# EAGLE design SSTuino_Evo (EAGLE 9.6.2)

## Sheet 1 of 2
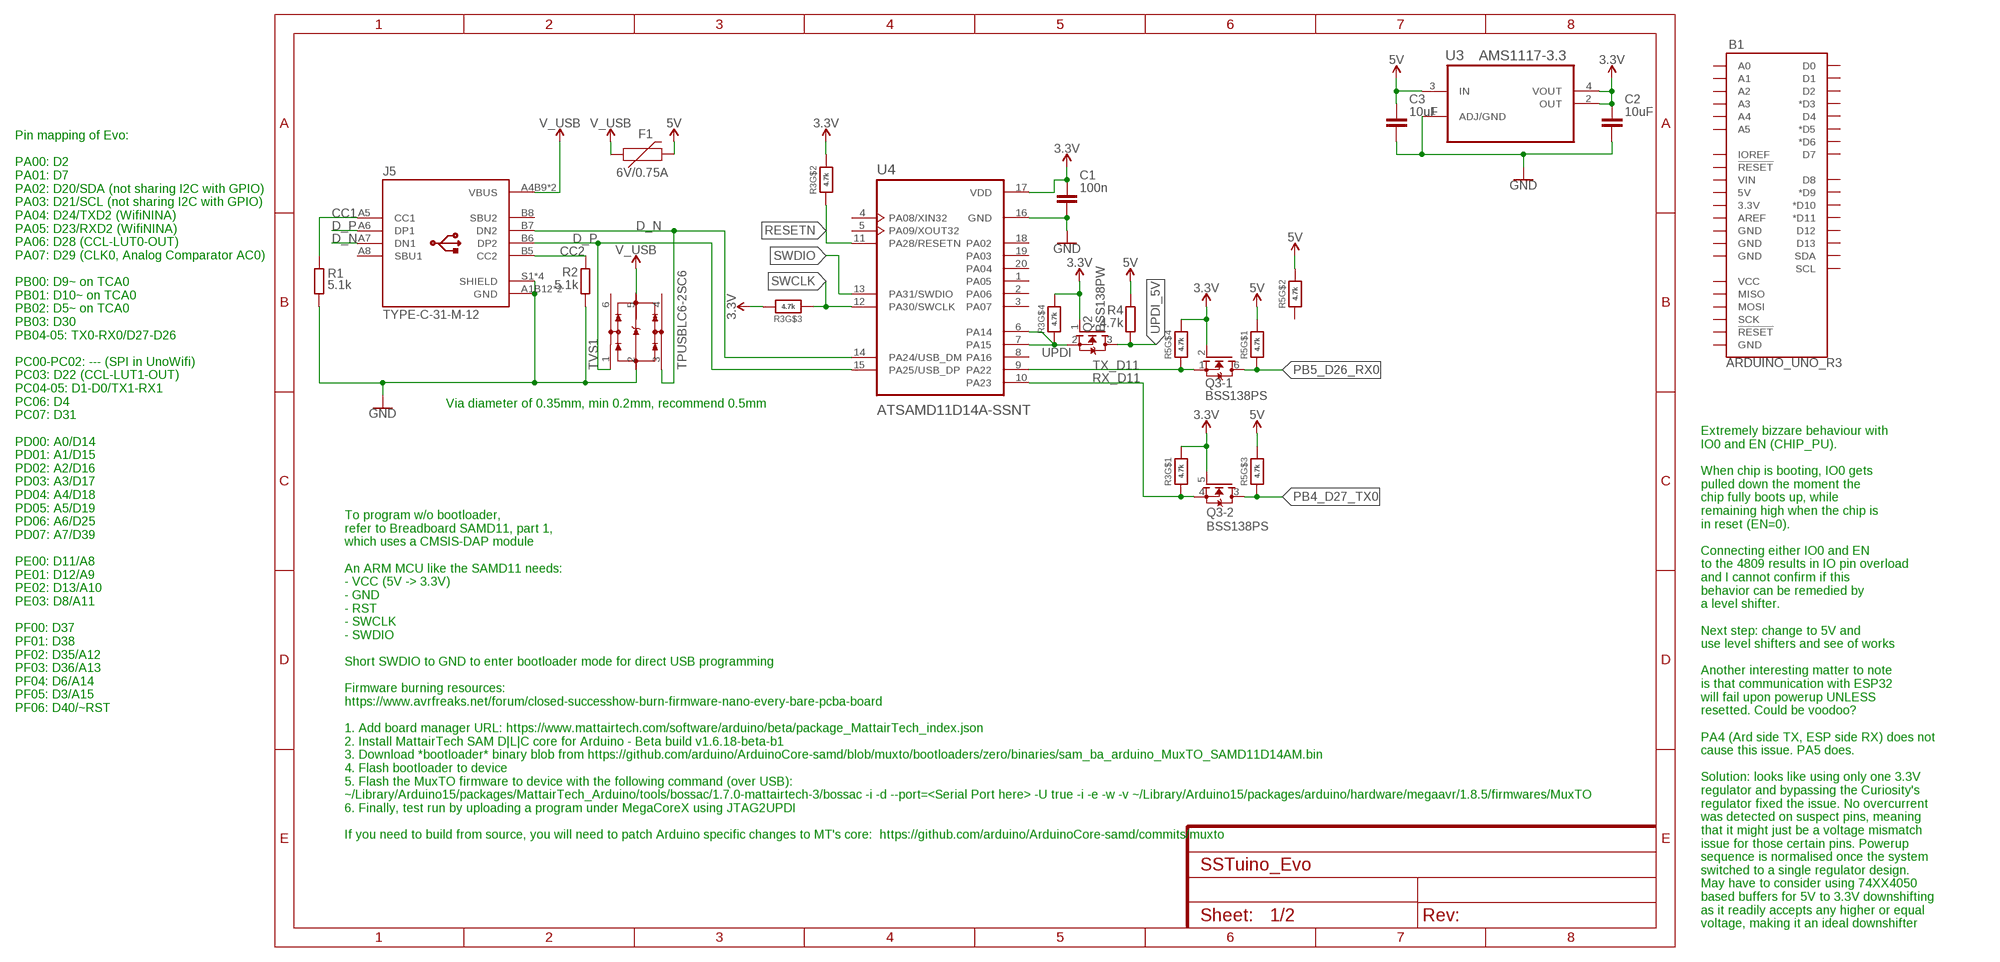
[diagram p0: schematic, sheet 1]

### Parts
B1  ARDUINO_UNO_R3  [ARDUINO_R3]
C1  100n  C_CHIP-0402(1005-METRIC)  [CAPC1005X60]
C2  10uF  C_CHIP-0603(1608-METRIC)  [CAPC1608X85]
C3  10uF  C_CHIP-0603(1608-METRIC)  [CAPC1608X85]
F1  6V/0.75A  PPTC_THREE-QUARTER-AMP  [1206]
J5  TYPE-C-31-M-12  [HRO_TYPE-C-31-M-12]
Q2  BSS138PW  [SOT65P210X110-3N]
Q3  BSS138PS  [ARDUINO-TRANSISTORS_SOT363]
R1  5.1k  R_CHIP-0402(1005-METRIC)  [RESC1005X40]
R2  5.1k  R_CHIP-0402(1005-METRIC)  [RESC1005X40]
R3  4.7k  RESISTOR_4PACK0402  [RESPACK_4X0402]
R4  4.7k  R_CHIP-0402(1005-METRIC)  [RESC1005X40]
R5  4.7k  RESISTOR_4PACK0402  [RESPACK_4X0402]
TVS1  TPUSBLC6-2SC6  [SOT95P280X110-6N]
U3  AMS1117-3.3  LM1117MP-3.3  [SOT230P696X180-4N]
U4  ATSAMD11D14A-SSNT  [SOIC127P1030X265-20N]

### Nets
3.3V: C1.1 C2.1 Q2.1(G) Q3.2(-1:G) Q3.5(-2:G) R3.5 R3.6 R3.7 R3.8 R5.5 U3.2(OUT) U3.4(VOUT) U4.17(VDD) ; also sheet 2
5V: C3.1 F1.2 R4.2 R5.6 R5.7 R5.8 U3.3(IN) ; also sheet 2
CC1: J5.A5(CC1) R1.1
CC2: J5.B5(CC2) R2.2
D_N [differential]: J5.A7(DN1) J5.B7(DN2) TVS1.3(IO2) U4.14(PA24/USB_DM)
D_P [differential]: J5.A6(DP1) J5.B6(DP2) TVS1.1(IO1) U4.15(PA25/USB_DP)
GND: C1.2 C2.2 C3.2 J5.A1B12(GND) J5.B1A12(GND) J5.S1(SHIELD) J5.S2(SHIELD) J5.S3(SHIELD) J5.S4(SHIELD) R1.2 R2.1 TVS1.2(VSS) U3.1(ADJ/GND) U4.16(GND) ; also sheet 2
PB4_D27_TX0: Q3.3(-2:D) R5.3 ; also sheet 2
PB5_D26_RX0: Q3.6(-1:D) R5.1 ; also sheet 2
RESETN: R3.2 U4.11(PA28/RESETN) ; also sheet 2
RX_D11: Q3.4(-2:S) R3.1 U4.10(PA23)
SWCLK: R3.3 U4.12(PA30/SWCLK) ; also sheet 2
SWDIO: U4.13(PA31/SWDIO) ; also sheet 2
TX_D11: Q3.1(-1:S) R5.4 U4.9(PA22)
UPDI: Q2.2(S) R3.4 U4.6(PA14) U4.7(PA15)
UPDI_5V: Q2.3(D) R4.1 ; also sheet 2
V_USB: F1.1 J5.A4B9(VBUS) J5.B4A9(VBUS) TVS1.5(VCC)
Unconnected: B1.3.3V B1.5V B1.A0 B1.A1 B1.A2 B1.A3 B1.A4 B1.A5 B1.AREF B1.D0 B1.D1 B1.D2 B1.D3(*D3) B1.D4 B1.D5(*D5) B1.D6(*D6) B1.D7 B1.D8 B1.D9(*D9) B1.D10(*D10) B1.D11(*D11) B1.D12 B1.D13 B1.GND@1(GND) B1.GND@2(GND) B1.GND@3(GND) B1.GND@4(GND) B1.IOREF B1.MISO B1.MOSI B1.RESET@1(!RESET!) B1.RESET@2(!RESET!) B1.SCK B1.SCL B1.SDA B1.VCC B1.VIN J5.A8(SBU1) J5.B8(SBU2) R5.2 TVS1.4(IO3) TVS1.6(IO4) U4.1(PA05) U4.2(PA06) U4.3(PA07) U4.4(PA08/XIN32) U4.5(PA09/XOUT32) U4.8(PA16) U4.18(PA02) U4.19(PA03) U4.20(PA04)

### Notes on the sheet
- Via diameter of 0.35mm, min 0.2mm, recommend 0.5mm
- Pin mapping of Evo:
  
  PA00: D2
  PA01: D7
  PA02: D20/SDA (not sharing I2C with GPIO)
  PA03: D21/SCL (not sharing I2C with GPIO)
  PA04: D24/TXD2 (WifiNINA)
  PA05: D23/RXD2 (WifiNINA)
  PA06: D28 (CCL-LUT0-OUT)
  PA07: D29 (CLK0, Analog Comparator AC0)
  
  PB00: D9~ on TCA0
  PB01: D10~ on TCA0
  PB02: D5~ on TCA0
  PB03: D30
  PB04-05: TX0-RX0/D27-D26
  
  PC00-PC02: --- (SPI in UnoWifi)
  PC03: D22 (CCL-LUT1-OUT)
  PC04-05: D1-D0/TX1-RX1
  PC06: D4
  PC07: D31
  
  PD00: A0/D14
  PD01: A1/D15
  PD02: A2/D16
  PD03: A3/D17
  PD04: A4/D18
  PD05: A5/D19
  PD06: A6/D25
  PD07: A7/D39
  
  PE00: D11/A8
  PE01: D12/A9
  PE02: D13/A10
  PE03: D8/A11
  
  PF00: D37
  PF01: D38
  PF02: D35/A12
  PF03: D36/A13
  PF04: D6/A14
  PF05: D3/A15
  PF06: D40/~RST
- To program w/o bootloader,
  refer to Breadboard SAMD11, part 1,
  which uses a CMSIS-DAP module
  
  An ARM MCU like the SAMD11 needs:
  - VCC (5V -> 3.3V)
  - GND
  - RST
  - SWCLK
  - SWDIO
  
  Short SWDIO to GND to enter bootloader mode for direct USB programming
  
  Firmware burning resources:
  https://www.avrfreaks.net/forum/closed-successhow-burn-firmware-nano-every-bare-pcba-board
  
  1. Add board manager URL: https://www.mattairtech.com/software/arduino/beta/package_MattairTech_index.json
  2. Install MattairTech SAM D|L|C core for Arduino - Beta build v1.6.18-beta-b1
  3. Download *bootloader* binary blob from https://github.com/arduino/ArduinoCore-samd/blob/muxto/bootloaders/zero/binaries/sam_ba_arduino_MuxTO_SAMD11D14AM.bin
  4. Flash bootloader to device
  5. Flash the MuxTO firmware to device with the following command (over USB): 
  ~/Library/Arduino15/packages/MattairTech_Arduino/tools/bossac/1.7.0-mattairtech-3/bossac -i -d --port=<Serial Port here> -U true -i -e -w -v ~/Library/Arduino15/packages/arduino/hardware/megaavr/1.8.5/firmwares/MuxTO
  6. Finally, test run by uploading a program under MegaCoreX using JTAG2UPDI
  
  If you need to build from source, you will need to patch Arduino specific changes to MT's core:  https://github.com/arduino/ArduinoCore-samd/commits/muxto
- Extremely bizzare behaviour with
  IO0 and EN (CHIP_PU). 
  
  When chip is booting, IO0 gets 
  pulled down the moment the 
  chip fully boots up, while 
  remaining high when the chip is
  in reset (EN=0).
  
  Connecting either IO0 and EN
  to the 4809 results in IO pin overload
  and I cannot confirm if this
  behavior can be remedied by
  a level shifter. 
  
  Next step: change to 5V and
  use level shifters and see of works
  
  Another interesting matter to note
  is that communication with ESP32
  will fail upon powerup UNLESS
  resetted. Could be voodoo?
  
  PA4 (Ard side TX, ESP side RX) does not
  cause this issue. PA5 does.
  
  Solution: looks like using only one 3.3V 
  regulator and bypassing the Curiosity's
  regulator fixed the issue. No overcurrent
  was detected on suspect pins, meaning
  that it might just be a voltage mismatch
  issue for those certain pins. Powerup
  sequence is normalised once the system
  switched to a single regulator design.
  May have to consider using 74XX4050
  based buffers for 5V to 3.3V downshifting
  as it readily accepts any higher or equal
  voltage, making it an ideal downshifter

## Sheet 2 of 2
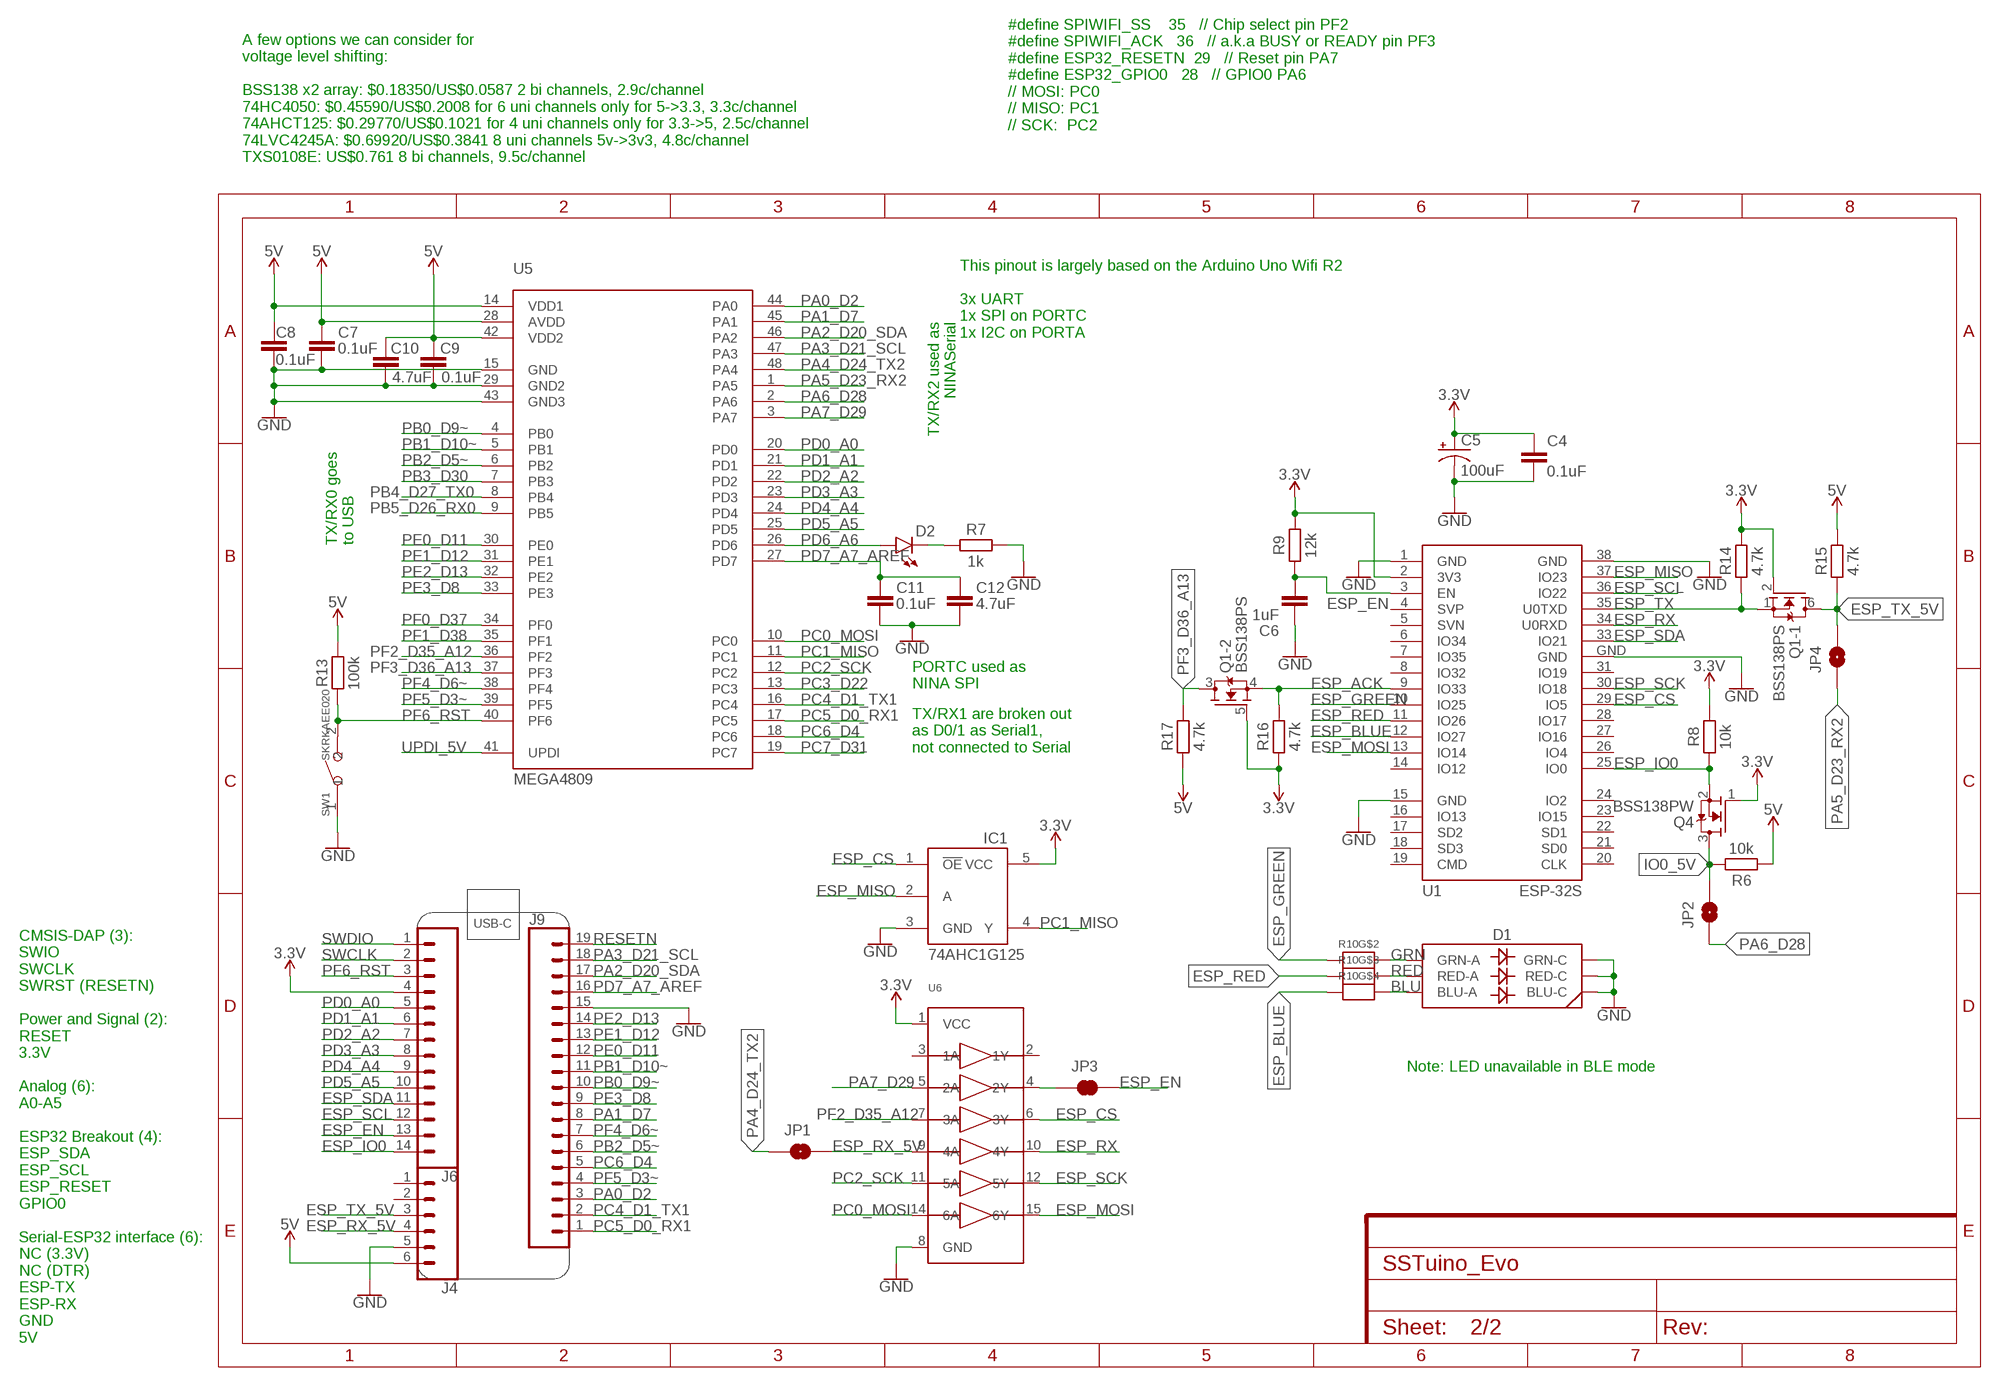
[diagram p1: schematic, sheet 2]

### Parts
C4  0.1uF  C_CHIP-0402(1005-METRIC)  [CAPC1005X60]
C5  100uF  C-POL-US_TANTALUM-1206(3216-METRIC)  [CAPMP3216X180N]
C6  1uF  C_CHIP-0402(1005-METRIC)  [CAPC1005X60]
C7  0.1uF  C_CHIP-0402(1005-METRIC)  [CAPC1005X60]
C8  0.1uF  C_CHIP-0402(1005-METRIC)  [CAPC1005X60]
C9  0.1uF  C_CHIP-0402(1005-METRIC)  [CAPC1005X60]
C10  4.7uF  C_CHIP-0402(1005-METRIC)  [CAPC1005X60]
C11  0.1uF  C_CHIP-0402(1005-METRIC)  [CAPC1005X60]
C12  4.7uF  C_CHIP-0402(1005-METRIC)  [CAPC1005X60]
D1  LED-RGBTC5050RGBF08  [LED-TRICOLOR-5050]
D2  LED0603  [LED-0603]
IC1  74AHC1G125  [SOT23-5L]
J4  CONN_06NO_SILK_FEMALE_PTH  [1X06_NO_SILK]
J6  CONN_14NO_SILK  [1X14_NO_SILK]
J9  CONN_191X19_NO_SILK  [1X19_NO_SILK]
JP1  JUMPER-SMT_2_NO_SILK  [SMT-JUMPER_2_NO_SILK]
JP2  JUMPER-SMT_2_NO_SILK  [SMT-JUMPER_2_NO_SILK]
JP3  JUMPER-SMT_2_NC_TRACE_SILK  [SMT-JUMPER_2_NC_TRACE_SILK]
JP4  JUMPER-SMT_2_NO_SILK  [SMT-JUMPER_2_NO_SILK]
Q1  BSS138PS  [ARDUINO-TRANSISTORS_SOT363]
Q4  BSS138PW  [SOT65P210X110-3N]
R6  10k  R_CHIP-0402(1005-METRIC)  [RESC1005X40]
R7  1k  R_CHIP-0402(1005-METRIC)  [RESC1005X40]
R8  10k  R_CHIP-0402(1005-METRIC)  [RESC1005X40]
R9  12k  R_CHIP-0402(1005-METRIC)  [RESC1005X40]
R10  RESISTOR_4PACK0402  [RESPACK_4X0402]
R13  100k  R_CHIP-0402(1005-METRIC)  [RESC1005X40]
R14  4.7k  R_CHIP-0402(1005-METRIC)  [RESC1005X40]
R15  4.7k  R_CHIP-0402(1005-METRIC)  [RESC1005X40]
R16  4.7k  R_CHIP-0402(1005-METRIC)  [RESC1005X40]
R17  4.7k  R_CHIP-0402(1005-METRIC)  [RESC1005X40]
SW1  SKRKAEE020  SMD-BUTTON(2P-3.9X2.9X1.5+0.4MM)-SKRKAEE020  [SW2-2.6-3.9X2.9X1.5+0.4MM]
U1  ESP-32S  [ESP-32S]
U5  MEGA4809  [TQFP48]
U6  74HC4050DTSSOP  [TSSOP16]

### Nets
3.3V: C4.1 C5.1(+) IC1.5(VCC) J6.4 Q1.2(-1:G) Q1.5(-2:G) Q4.1(G) R8.2 R9.2 R14.2 R16.1 U1.2(3V3) U6.1(VCC) ; also sheet 1
5V: C7.1 C8.1 C9.1 C10.1 J4.6 R6.1 R13.2 R15.2 R17.1 U5.14(VDD1) U5.28(AVDD) U5.42(VDD2) ; also sheet 1
BLU: D1.6(BLU-A) R10.5
ESP_ACK: Q1.4(-2:S) R16.2 U1.9(IO33)
ESP_BLUE: R10.4 U1.12(IO27)
ESP_CS: IC1.1(!OE) U1.29(IO5) U6.6(3Y)
ESP_EN: C6.2 J6.13 JP3.2 R9.1 U1.3(EN)
ESP_GREEN: R10.2 U1.10(IO25)
ESP_IO0: J6.14 Q4.2(S) R8.1 U1.25(IO0)
ESP_MISO: IC1.2(A) U1.37(IO23)
ESP_MOSI: U1.13(IO14) U6.15(6Y)
ESP_RED: R10.3 U1.11(IO26)
ESP_RX: U1.34(U0RXD) U6.10(4Y)
ESP_RX_5V: J4.4 JP1.2 U6.9(4A)
ESP_SCK: U1.30(IO18) U6.12(5Y)
ESP_SCL: J6.12 U1.36(IO22)
ESP_SDA: J6.11 U1.33(IO21)
ESP_TX: Q1.1(-1:S) R14.1 U1.35(U0TXD)
ESP_TX_5V: J4.3 JP4.2 Q1.6(-1:D) R15.1
GND: C4.2 C5.2(-) C6.1 C7.2 C8.2 C9.2 C10.2 C11.2 C12.2 D1.1(BLU-C) D1.2(RED-C) D1.3(GRN-C) IC1.3(GND) J4.5 J9.15 R7.2 SW1.1 U1.1(GND) U1.15(GND) U1.38(GND) U1.GND U5.15(GND) U5.29(GND2) U5.43(GND3) U6.8(GND) ; also sheet 1
GRN: D1.4(GRN-A) R10.7
IO0_5V: JP2.2 Q4.3(D) R6.2
N$2: D2.C R7.1
N$3: JP3.1 U6.4(2Y)
PA0_D2: J9.3 U5.44(PA0)
PA1_D7: J9.8 U5.45(PA1)
PA2_D20_SDA: J9.17 U5.46(PA2)
PA3_D21_SCL: J9.18 U5.47(PA3)
PA4_D24_TX2: JP1.1 U5.48(PA4)
PA5_D23_RX2: JP4.1 U5.1(PA5)
PA6_D28: JP2.1 U5.2(PA6)
PA7_D29: U5.3(PA7) U6.5(2A)
PB0_D9~: J9.10 U5.4(PB0)
PB1_D10~: J9.11 U5.5(PB1)
PB2_D5~: J9.6 U5.6(PB2)
PB3_D30: U5.7(PB3)
PB4_D27_TX0: U5.8(PB4) ; also sheet 1
PB5_D26_RX0: U5.9(PB5) ; also sheet 1
PC0_MOSI: U5.10(PC0) U6.14(6A)
PC1_MISO: IC1.4(Y) U5.11(PC1)
PC2_SCK: U5.12(PC2) U6.11(5A)
PC3_D22: U5.13(PC3)
PC4_D1_TX1: J9.2 U5.16(PC4)
PC5_D0_RX1: J9.1 U5.17(PC5)
PC6_D4: J9.5 U5.18(PC6)
PC7_D31: U5.19(PC7)
PD0_A0: J6.5 U5.20(PD0)
PD1_A1: J6.6 U5.21(PD1)
PD2_A2: J6.7 U5.22(PD2)
PD3_A3: J6.8 U5.23(PD3)
PD4_A4: J6.9 U5.24(PD4)
PD5_A5: J6.10 U5.25(PD5)
PD6_A6: D2.A U5.26(PD6)
PD7_A7_AREF: C11.1 C12.1 J9.16 U5.27(PD7)
PE0_D11: J9.12 U5.30(PE0)
PE1_D12: J9.13 U5.31(PE1)
PE2_D13: J9.14 U5.32(PE2)
PE3_D8: J9.9 U5.33(PE3)
PF0_D37: U5.34(PF0)
PF1_D38: U5.35(PF1)
PF2_D35_A12: U5.36(PF2) U6.7(3A)
PF3_D36_A13: Q1.3(-2:D) R17.2 U5.37(PF3)
PF4_D6~: J9.7 U5.38(PF4)
PF5_D3~: J9.4 U5.39(PF5)
PF6_RST: J6.3 R13.1 SW1.2 U5.40(PF6)
RED: D1.5(RED-A) R10.6
RESETN: J9.19 ; also sheet 1
SWCLK: J6.2 ; also sheet 1
SWDIO: J6.1 ; also sheet 1
UPDI_5V: U5.41(UPDI) ; also sheet 1
Unconnected: J4.1 J4.2 R10.1 R10.8 U1.4(SVP) U1.5(SVN) U1.6(IO34) U1.7(IO35) U1.8(IO32) U1.14(IO12) U1.16(IO13) U1.17(SD2) U1.18(SD3) U1.19(CMD) U1.20(CLK) U1.21(SD0) U1.22(SD1) U1.23(IO15) U1.24(IO2) U1.26(IO4) U1.27(IO16) U1.28(IO17) U1.31(IO19) U6.2(1Y) U6.3(1A)

### Notes on the sheet
- #define SPIWIFI_SS    35   // Chip select pin PF2
  #define SPIWIFI_ACK   36   // a.k.a BUSY or READY pin PF3
  #define ESP32_RESETN  29   // Reset pin PA7
  #define ESP32_GPIO0   28   // GPIO0 PA6
  // MOSI: PC0
  // MISO: PC1
  // SCK:  PC2
- A few options we can consider for
  voltage level shifting:
  
  BSS138 x2 array: $0.18350/US$0.0587 2 bi channels, 2.9c/channel
  74HC4050: $0.45590/US$0.2008 for 6 uni channels only for 5->3.3, 3.3c/channel
  74AHCT125: $0.29770/US$0.1021 for 4 uni channels only for 3.3->5, 2.5c/channel
  74LVC4245A: $0.69920/US$0.3841 8 uni channels 5v->3v3, 4.8c/channel
  TXS0108E: US$0.761 8 bi channels, 9.5c/channel
- TX/RX2 used as
  NINASerial
- This pinout is largely based on the Arduino Uno Wifi R2
  
  3x UART
  1x SPI on PORTC
  1x I2C on PORTA
- TX/RX0 goes
  to USB
- PORTC used as
  NINA SPI
- TX/RX1 are broken out 
  as D0/1 as Serial1,
  not connected to Serial
- USB-C
- Note: LED unavailable in BLE mode
- CMSIS-DAP (3):
  SWIO
  SWCLK
  SWRST (RESETN)
  
  Power and Signal (2):
  RESET
  3.3V
  
  Analog (6):
  A0-A5
  
  ESP32 Breakout (4):
  ESP_SDA
  ESP_SCL
  ESP_RESET
  GPIO0
  
  Serial-ESP32 interface (6):
  NC (3.3V)
  NC (DTR)
  ESP-TX
  ESP-RX
  GND
  5V

## Library data of the parts
B1 = SparkFun-Boards:ARDUINO_UNO_R3: Arduino R3 Footprint with SPI header Arduino Uno R3 Compatible Footprint. Matches PCB size of the original board. SparkFun Products: SAMD21 Dev Breakout <https://www.sparkfun.com/products/13672> RedBoard <https://www.sparkfun.com/products/12757> R3 Stackable Headers <https://www.sparkfun.com/products/11417>
C1-C4 C6-C12 = Capacitor:C: Capacitor - Generic; CATEGORY: Capacitor
C5 = Capacitor:C-POL-US: Capacitor Polarised - ANSI; CATEGORY: Capacitor
D1 = D3ltav's Custom:LED-RGB: LED-RGB 6 pin RGB LED (no common connector) Warning: please check and double check your pinout vs. the datasheet! 5050 SMD LEDs are commonly packaged in all sorts of weird, non-standard pinouts. This footprint and symbol is only applicable to the LED mentioned below Packages: LED-TRICOLOR-5050 - Based on TC5050RGBF08 RGB LED <https://datasheet.lcsc.com/szlcsc/2009231707_TCWIN-TC5050RGBF08-3CJH-AF53A_C784540.pdf>; PROD_ID: DIO-10298
D2 = SparkFun-LED:LED: LED (Generic) Standard schematic elements and footprints for 5mm, 3mm, 1206, and 0603 sized LEDs. Generic LEDs with no color specified.
F1 = SparkFun-Fuses:PPTC: Resettable Fuse PPTC Resettable Fuse. Really a sort of resistor with a polymeric positive temperature coefficient whose resistance increases dramatically with an increase in temperature. When heated by the power passing through the resistance rises causing the current to be limited, protecting the circuit. This is achieved by the transition of the polymer from a crystalline to an amorphous state where the conductive carbon separates breaking the conductive pathways found in the cool crystalline structure. When a PPTC cools back down it resumes conducting letting the circuit turn back on. SparkFun Products: SparkFun RedBoard - Programmed with Arduino <https://www.sparkfun.com/products/12757> Pro Micro - 5V/16MHz <https://www.sparkfun.com/products/12640> Arduino Pro 328 - 5V/16MHz <https://www.sparkfun.com/products/10915> MP3 Trigger <https://www.sparkfun.com/products/13720>; LCSC_PART: C99563; PROD_ID: RES-11150
IC1 = adafruit:74AHC1G125; LCSC_PART: C124295
J4 = SparkFun-Connectors:CONN_06: Multi connection point. Often used as Generic Header-pin footprint for 0.1 inch spaced/style header connections On any of the 0.1 inch spaced packages, you can populate with these: Break Away Headers - Straight <https://www.sparkfun.com/products/116> (PRT-00116) Break Away Male Headers - Right Angle <https://www.sparkfun.com/products/553> (PRT-00553) Female Headers <https://www.sparkfun.com/products/115> (PRT-00115) Break Away Headers - Machine Pin <https://www.sparkfun.com/products/117> (PRT-00117) Break Away Female Headers - Swiss Machine Pin <https://www.sparkfun.com/products/743> (PRT-00743) Arduino Stackable Header - 6 Pin <https://www.sparkfun.com/products/9280> (PRT-09280) For SCREWTERMINALS and SPRING TERMINALS visit here: Screw Terimnals on SparkFun.com <https://www.sparkfun.com/search/results?term=Screw+Terminals> (5mm/3.5mm/2.54mm spacing) This device is also useful as a general connection point to wire up your design to another part of your project. Our various solder wires solder well into these plated through hole pads. Hook-Up Wire - Assortment (Stranded, 22 AWG) <https://www.sparkfun.com/products/11375> (PRT-11375) Hook-Up Wire - Assortment (Solid Core, 22 AWG) <https://www.sparkfun.com/products/11367> (PRT-11367) View the entire wire category on our website here <https://www.sparkfun.com/categories/141>; PROD_ID: CONN-08437
J5 = D3ltav's Custom:TYPE-C-31-M-12: USB Connectors 24 Receptacle 1 8.94*7.3mm RoHS Check prices <https://pricing.snapeda.com/parts/TYPE-C-31-M-12/HRO%20Electronics%20Co.%2C%20Ltd./view-part?ref=eda>; AVAILABILITY: No availability data; DESCRIPTION: USB Connectors 24 Receptacle 1 8.94*7.3mm RoHS; LCSC_PART: C165948; MF: HRO Electronics Co., Ltd.; MP: TYPE-C-31-M-12; PACKAGE: Package; PRICE: None
J6 = SparkFun-Connectors:CONN_14: Multi connection point. Often used as Generic Header-pin footprint for 0.1 inch spaced/style header connections On any of the 0.1 inch spaced packages, you can populate with these: Break Away Headers - Straight <https://www.sparkfun.com/products/116> (PRT-00116) Break Away Male Headers - Right Angle <https://www.sparkfun.com/products/553> (PRT-00553) Female Headers <https://www.sparkfun.com/products/115> (PRT-00115) Break Away Headers - Machine Pin <https://www.sparkfun.com/products/117> (PRT-00117) Break Away Female Headers - Swiss Machine Pin <https://www.sparkfun.com/products/743> (PRT-00743) For SCREWTERMINALS and SPRING TERMINALS visit here: Screw Terimnals on SparkFun.com <https://www.sparkfun.com/search/results?term=Screw+Terminals> (5mm/3.5mm/2.54mm spacing) This device is also useful as a general connection point to wire up your design to another part of your project. Our various solder wires solder well into these plated through hole pads. Hook-Up Wire - Assortment (Stranded, 22 AWG) <https://www.sparkfun.com/products/11375> (PRT-11375) Hook-Up Wire - Assortment (Solid Core, 22 AWG) <https://www.sparkfun.com/products/11367> (PRT-11367) View the entire wire category on our website here <https://www.sparkfun.com/categories/141> Special notes: Molex polarized connector foot print use with SKU : PRT-08231 with associated crimp pins and housings. 1MM SMD Version SKU: PRT-10208 NOTES ON THE VARIANTS LOCK and LOCK_LONGPADS... This footprint was designed to help hold the alignment of a through-hole component (i.e. 6-pin header) while soldering it into place. You may notice that each hole has been shifted either up or down by 0.005 of an inch from it's more standard position (which is a perfectly straight line). This slight alteration caused the pins (the squares in the middle) to touch the edges of the holes. Because they are alternating, it causes a "brace" to hold the component in place. 0.005 has proven to be the perfect amount of "off-center" position when using our standard breakaway headers. Although looks a little odd when you look at the bare footprint, once you have a header in there, the alteration is very hard to notice. Also,if you push a header all the way into place, it is covered up entirely on the bottom side.
J9 = SparkFun-Connectors:CONN_19: Multi connection point. Often used as Generic Header-pin footprint for 0.1 inch spaced/style header connections On any of the 0.1 inch spaced packages, you can populate with these: Break Away Headers - Straight <https://www.sparkfun.com/products/116> (PRT-00116) Break Away Male Headers - Right Angle <https://www.sparkfun.com/products/553> (PRT-00553) Female Headers <https://www.sparkfun.com/products/115> (PRT-00115) Break Away Headers - Machine Pin <https://www.sparkfun.com/products/117> (PRT-00117) Break Away Female Headers - Swiss Machine Pin <https://www.sparkfun.com/products/743> (PRT-00743) For SCREWTERMINALS and SPRING TERMINALS visit here: Screw Terimnals on SparkFun.com <https://www.sparkfun.com/search/results?term=Screw+Terminals> (5mm/3.5mm/2.54mm spacing) This device is also useful as a general connection point to wire up your design to another part of your project. Our various solder wires solder well into these plated through hole pads. Hook-Up Wire - Assortment (Stranded, 22 AWG) <https://www.sparkfun.com/products/11375> (PRT-11375) Hook-Up Wire - Assortment (Solid Core, 22 AWG) <https://www.sparkfun.com/products/11367> (PRT-11367) View the entire wire category on our website here <https://www.sparkfun.com/categories/141> Special notes: Molex polarized connector foot print use with SKU : PRT-08231 with associated crimp pins and housings. 1MM SMD Version SKU: PRT-10208 NOTES ON THE VARIANTS LOCK and LOCK_LONGPADS... This footprint was designed to help hold the alignment of a through-hole component (i.e. 6-pin header) while soldering it into place. You may notice that each hole has been shifted either up or down by 0.005 of an inch from it's more standard position (which is a perfectly straight line). This slight alteration caused the pins (the squares in the middle) to touch the edges of the holes. Because they are alternating, it causes a "brace" to hold the component in place. 0.005 has proven to be the perfect amount of "off-center" position when using our standard breakaway headers. Although looks a little odd when you look at the bare footprint, once you have a header in there, the alteration is very hard to notice. Also,if you push a header all the way into place, it is covered up entirely on the bottom side.
JP1 JP2 JP4 = SparkFun-Jumpers:JUMPER-SMT_2_NO: Normally open jumper This jumper has two pads in close proximity to each other. Apply solder to close the connection. Round pads are easier to solder for beginners, but are a lot larger. SparkFun Product that uses the round pads: SparkFun EL Sequencer <https://www.sparkfun.com/products/12781>
JP3 = SparkFun-Jumpers:JUMPER-SMT_2_NC_TRACE: Normally closed trace jumper This jumper has a trace between two pads so it's normally closed (NC). Use a razor knife to open the connection. For best results follow the IPC guidelines for cutting traces: Cutout at least 0.063 mm (0.005 in). Remove all loose material to clean up the cut area. Seal the cut with an approved epoxy. Reapply solder to reclose the connection.
Q1 Q3 = D3ltav's Custom:BSS138PS: MOSFET 2N-CH 60V 0.32A 6TSSOP; CODE-ARDUINO: 2323; DATASHEET: https://assets.nexperia.com/documents/data-sheet/BSS138PS.pdf; DISTRIBUTOR-LINK: http://www.digikey.com/product-detail/en/nxp-semiconductors/BSS138PS,115/568-8393-1-ND/2763927; DISTRIBUTOR-PN: 568-8393-1-ND; LCSC_PART: C193381; MANUFACTURER: NXP; MANUFACTURER-PN: BSS138PS,115
Q2 Q4 = D3ltav's Custom:BSS138PW: N-channel Trench MOSFET Check prices <https://pricing.snapeda.com/parts/BSS138PW/NXP%20Semiconductors/view-part?ref=eda>; AVAILABILITY: In Stock; DESCRIPTION: N-Channel 60V 320mA (Ta) 260mW (Ta), 830mW (Tc) Surface Mount SC-70; MF: NXP Semiconductors; MP: BSS138PW; PACKAGE: SC-70 NXP Semiconductors; PRICE: None
R1 R2 R4 R6-R9 R13-R17 = Resistor:R: Resistor Fixed - Generic; CATEGORY: Resistor; SUB-CATEGORY: Fixed
R3 R5 = D3ltav's Custom:RESISTOR_4PACK: Resistor Packs (4 resistors) 4 x 0603 10K 1/16W - Digikey: YC164J-10KCT-ND; LCSC_PART: C1980
R10 = D3ltav's Custom:RESISTOR_4PACK: Resistor Packs (4 resistors) 4 x 0603 10K 1/16W - Digikey: YC164J-10KCT-ND
SW1 = D3ltav's Custom:SMD-BUTTON(2P-3.9X2.9X1.5+0.4MM): 311020047; LCSC_PART: C115357; MPN: SKRKAEE020
TVS1 = D3ltav's Custom:TPUSBLC6-2SC6: TPUSBLC6-2SC6 Low Capacitance 2-Line ESD Protection www.sot23.com.tw; LCSC_PART: C558442
U1 = esp32:ESP-32S: Ai-Thinker ESP-32S
U3 = D3ltav's Custom:LM1117MP-3.3: Linear regulators; LCSC_PART: C6186; MPN: LM1117MP-3.3; OC_FARNELL: 9778195; OC_NEWARK: 41K3470; PACKAGE: SOT223-3; SUPPLIER: NationalSemiconductor
U4 = D3ltav's Custom:ATSAMD11D14A-SSNT; AVAILABILITY: In Stock; DESCRIPTION: ARM® Cortex®-M0+ SAM D11D Microcontroller IC 32-Bit 48MHz 16KB (16K x 8) FLASH 20-SOIC; LCSC_PART: C2053599; MF: Microchip; MP: ATSAMD11D14A-SSNT; PACKAGE: SOIC-20 Microchip; PRICE: None
U5 = microwavemont_ATMEGA4809:MEGA4809; LCSC_PART: C189475
U6 = D3ltav's Custom:74HC4050D: 6-channel level shifter 74HC4050D - 2V-6V Supply SOIC16 Digikey: 74HC4050D,653-ND Mouser: 771-74HC4050D-T TSSOP16 Digikey: 296-9215-1-ND Mouser:; LCSC_PART: C352825

## Net classes
0 default: width 0.203 mm, drill 0.35 mm
1 differential: width 0.254 mm

## Board
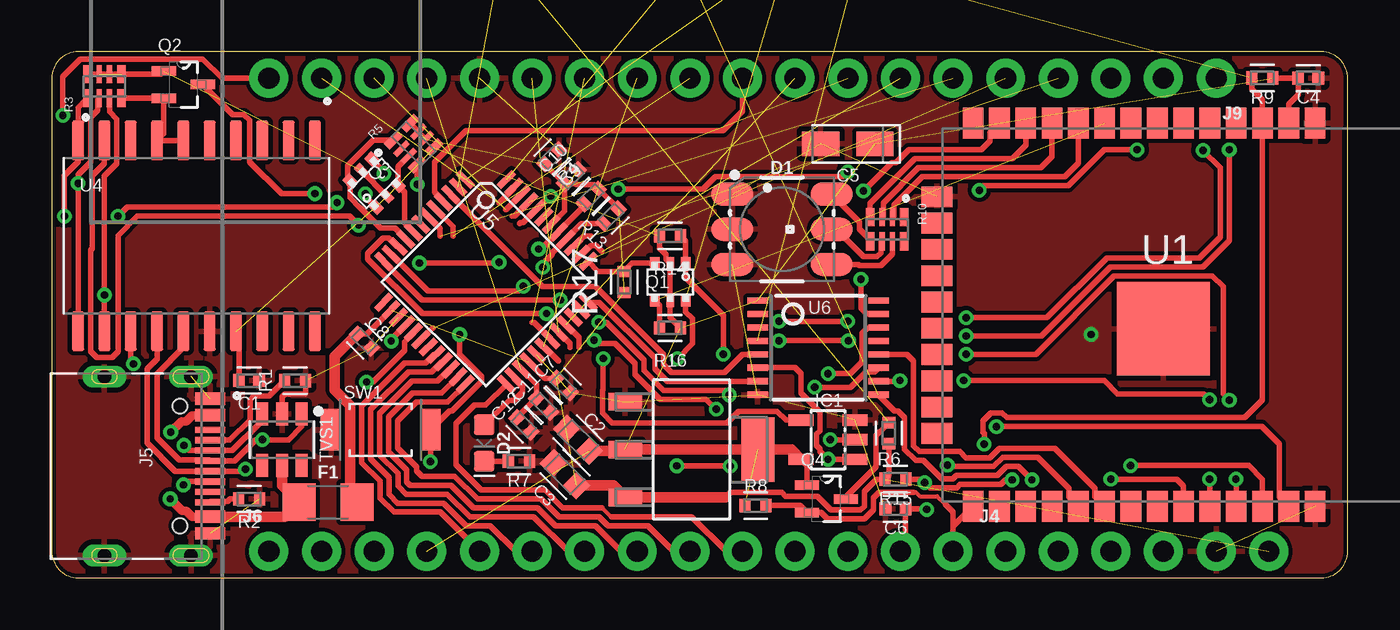
[diagram p2: board, top side]
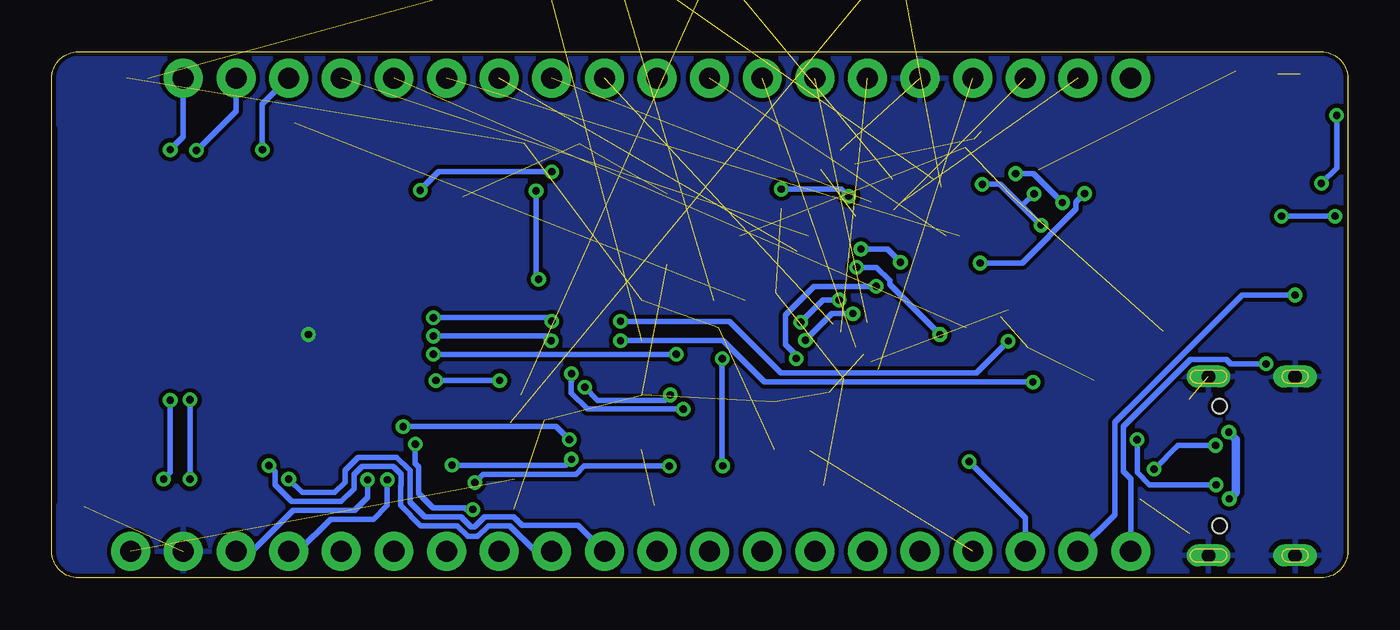
[diagram p3: board, bottom side, seen from below]

Size 62.55 x 25.4 mm. Coordinates in mm from the lower left corner, seen from the top.
Outline: 0,24.13 0,1.27 arc90 1.27,0 61.28,0 arc90 62.55,1.27 62.55,24.13 arc90 61.28,25.4 1.27,25.4 arc90 0,24.13
Copper layers (1*16): Top 0.035mm / dielectric 1.5mm / Bottom 0.035mm
Design rules "SparkFun-2-Layer-General-JLCPCB": minimum track width 7mil, minimum drill 0.3mm, track to track 7mil, track to pad 7mil, pad to pad 7mil, via to via 7mil, smd to smd 7mil, copper to edge 7mil, drill to drill 7mil, minimum pad ring 7mil, minimum via ring 7mil, stop-mask expansion 3mil, vias tented up to drill 25mil, thermal gap 10mil

### Footprints (pad centres in the part's own frame; a part is rotated, then mirrored left to right if it is on the bottom)
ARDUINO_R3 = drill 1.016 pad 1.93: 3.3V 2.54,-24.13; 5V 5.08,-24.13; A0 17.78,-24.13; A1 20.32,-24.13; A2 22.86,-24.13; A3 25.4,-24.13; A4 27.94,-24.13; A5 30.48,-24.13; AREF -9.144,24.13; D0 30.48,24.13; D1 27.94,24.13; D2 25.4,24.13; D3 22.86,24.13; D4 20.32,24.13; D5 17.78,24.13; D6 15.24,24.13; D7 12.7,24.13; D8 8.636,24.13; D9 6.096,24.13; D10 3.556,24.13; D11 1.016,24.13; D12 -1.524,24.13; D13 -4.064,24.13; GND@1 7.62,-24.13; GND@2 10.16,-24.13; GND@3 -6.604,24.13; GND@4 33.16,-1.32; IOREF -2.54,-24.13; MISO 30.62,3.76; MOSI 33.16,1.22; NC -5.08,-24.13; RESET@1 0,-24.13; RESET@2 30.62,-1.32; SCK 30.62,1.22; SCL -14.224,24.13; SDA -11.684,24.13; VCC 33.16,3.76; VIN 12.7,-24.13 | hole 3.175: -17.78,24.13; 33.02,8.89; 33.02,-19.05; -19.05,-24.13
CAPC1005X60 = smd 0.56 x 0.629: 1 -0.485,0; 2 0.485,0
CAPC1608X85 = smd 0.921 x 0.97: 1 -0.775,0; 2 0.775,0
CAPMP3216X180N = smd 1.796 x 1.189: 1 -1.31,0; 2 1.31,0
LED-TRICOLOR-5050 = smd 2 x 1.1: 1 2.4,-1.7; 2 2.4,0; 3 2.4,1.7; 4 -2.4,1.7; 5 -2.4,0; 6 -2.4,-1.7
LED-0603 = smd 1 x 1: A -0.877,0; C 0.877,0
1206 = smd 1.6 x 1.8: 1 -1.4,0; 2 1.4,0
SOT23-5L = smd 0.55 x 1.2: 1 -0.95,-1.3; 2 0,-1.3; 3 0.95,-1.3; 4 0.95,1.3; 5 -0.95,1.3
1X06_NO_SILK = drill 1.016 pad 1.88: 1 0,0; 2 2.54,0; 3 5.08,0; 4 7.62,0; 5 10.16,0; 6 12.7,0
HRO_TYPE-C-31-M-12 = smd 0.6 x 1.45: A1B12 -3.25,5.095; A4B9 -2.45,5.095; B1A12 3.25,5.095; B4A9 2.45,5.095 | smd 0.3 x 1.45: A5 -1.25,5.095; A6 -0.25,5.095; A7 0.25,5.095; A8 1.25,5.095; B5 1.75,5.095; B6 0.75,5.095; B7 -0.75,5.095; B8 -1.75,5.095 | drill 0.65 pad 1.05 long: S1 -4.32,4.18; S2 4.32,4.18; S3 -4.32,0; S4 4.32,0 | hole 0.7: -2.89,3.65; 2.89,3.65
1X14_NO_SILK = drill 1.016 pad 1.88: 1 0,0; 2 2.54,0; 3 5.08,0; 4 7.62,0; 5 10.16,0; 6 12.7,0; 7 15.24,0; 8 17.78,0; 9 20.32,0; 10 22.86,0; 11 25.4,0; 12 27.94,0; 13 30.48,0; 14 33.02,0
1X19_NO_SILK = drill 1.016 pad 1.88: 1 0,0; 2 2.54,0; 3 5.08,0; 4 7.62,0; 5 10.16,0; 6 12.7,0; 7 15.24,0; 8 17.78,0; 9 20.32,0; 10 22.86,0; 11 25.4,0; 12 27.94,0; 13 30.48,0; 14 33.02,0; 15 35.56,0; 16 38.1,0; 17 40.64,0; 18 43.18,0; 19 45.72,0
SMT-JUMPER_2_NO_SILK = smd 0.635 x 1.27: 1 -0.406,0; 2 0.406,0
SMT-JUMPER_2_NC_TRACE_SILK = smd 0.635 x 1.27: 1 -0.508,0; 2 0.508,0
ARDUINO-TRANSISTORS_SOT363 = smd 0.5 x 0.6: 1 -0.75,-0.9; 3 0.75,-0.9; 4 0.75,0.9; 6 -0.75,0.9 | smd 0.4 x 0.6: 2 0,-0.9; 5 0,0.9
SOT65P210X110-3N = smd 1.168 x 0.457: 1 -0.94,0.66; 2 -0.94,-0.66; 3 0.94,0
RESC1005X40 = smd 0.535 x 0.644: 1 -0.507,0; 2 0.507,0
RESPACK_4X0402 = smd 0.87 x 0.41: 1 -0.58,0.825; 4 -0.58,-0.825; 5 0.58,-0.825; 8 0.58,0.825 | smd 0.87 x 0.26: 2 -0.58,0.25; 3 -0.58,-0.25; 6 0.58,-0.25; 7 0.58,0.25
SW2-2.6-3.9X2.9X1.5+0.4MM = smd 1 x 2: 1 -2.4,0; 2 2.4,0
SOT95P280X110-6N = smd 1.119 x 0.584: 1 -1.246,0.95; 2 -1.246,0; 3 -1.246,-0.95; 4 1.246,-0.95; 5 1.246,0; 6 1.246,0.95
ESP-32S = smd 1.5 x 1: 1 -9.25,7; 2 -9.25,5.73; 3 -9.25,4.46; 4 -9.25,3.19; 5 -9.25,1.92; 6 -9.25,0.65; 7 -9.25,-0.62; 8 -9.25,-1.89; 9 -9.25,-3.16; 10 -9.25,-4.43; 11 -9.25,-5.7; 12 -9.25,-6.97; 13 -9.25,-8.24; 14 -9.25,-9.51; 25 9.25,-9.51; 26 9.25,-8.24; 27 9.25,-6.97; 28 9.25,-5.7; 29 9.25,-4.43; 30 9.25,-3.16; 31 9.25,-1.89; 32 9.25,-0.62; 33 9.25,0.65; 34 9.25,1.92; 35 9.25,3.19; 36 9.25,4.46; 37 9.25,5.73; 38 9.25,7 | smd 1 x 1.5: 15 -5.7,-11.25; 16 -4.43,-11.25; 17 -3.16,-11.25; 18 -1.89,-11.25; 19 -0.62,-11.25; 20 0.65,-11.25; 21 1.92,-11.25; 22 3.19,-11.25; 23 4.46,-11.25; 24 5.73,-11.25 | smd 4.5 x 4.5: GND 0.68,-0.33
SOT230P696X180-4N = smd 1.6 x 0.838: 1 -3.2,2.311; 2 -3.2,0; 3 -3.2,-2.311 | smd 1.6 x 3.099: 4 3.2,0
SOIC127P1030X265-20N = smd 1.9 x 0.6: 1 -4.605,5.715; 2 -4.605,4.445; 3 -4.605,3.175; 4 -4.605,1.905; 5 -4.605,0.635; 6 -4.605,-0.635; 7 -4.605,-1.905; 8 -4.605,-3.175; 9 -4.605,-4.445; 10 -4.605,-5.715; 11 4.605,-5.715; 12 4.605,-4.445; 13 4.605,-3.175; 14 4.605,-1.905; 15 4.605,-0.635; 16 4.605,0.635; 17 4.605,1.905; 18 4.605,3.175; 19 4.605,4.445; 20 4.605,5.715
TQFP48 = smd 1.016 x 0.305: 1 -4.191,2.794; 2 -4.191,2.286; 3 -4.191,1.778; 4 -4.191,1.27; 5 -4.191,0.762; 6 -4.191,0.254; 7 -4.191,-0.254; 8 -4.191,-0.762; 9 -4.191,-1.27; 10 -4.191,-1.778; 11 -4.191,-2.286; 12 -4.191,-2.794; 25 4.191,-2.794; 26 4.191,-2.286; 27 4.191,-1.778; 28 4.191,-1.27; 29 4.191,-0.762; 30 4.191,-0.254; 31 4.191,0.254; 32 4.191,0.762; 33 4.191,1.27; 34 4.191,1.778; 35 4.191,2.286; 36 4.191,2.794 | smd 0.305 x 1.016: 13 -2.794,-4.191; 14 -2.286,-4.191; 15 -1.778,-4.191; 16 -1.27,-4.191; 17 -0.762,-4.191; 18 -0.254,-4.191; 19 0.254,-4.191; 20 0.762,-4.191; 21 1.27,-4.191; 22 1.778,-4.191; 23 2.286,-4.191; 24 2.794,-4.191; 37 2.794,4.191; 38 2.286,4.191; 39 1.778,4.191; 40 1.27,4.191; 41 0.762,4.191; 42 0.254,4.191; 43 -0.254,4.191; 44 -0.762,4.191; 45 -1.27,4.191; 46 -1.778,4.191; 47 -2.286,4.191; 48 -2.794,4.191
TSSOP16 = smd 0.305 x 0.991: 1 -2.275,-2.918; 2 -1.625,-2.918; 3 -0.975,-2.918; 4 -0.325,-2.918; 5 0.325,-2.918; 6 0.975,-2.918; 7 1.625,-2.918; 8 2.275,-2.918; 9 2.275,2.918; 10 1.625,2.918; 11 0.975,2.918; 12 0.325,2.918; 13 -0.325,2.918; 14 -0.975,2.918; 15 -1.625,2.918; 16 -2.275,2.918

### Placement (x,y rotation side)
B1  41.27,11.43 0 top
C1  9.53,9.53 0 top
C2  25.4,6.67 135 top
C3  24.77,5 135 top
C4  60.64,24.13 0 top
C5  38.42,20.95 180 top
C6  40.72,3.33 0 top
C7  24.69,9.29 315 top
C8  15.08,11.43 315 top
C9  24.13,20.32 45 top
C10  25.08,19.37 45 top
C11  23.73,8.33 315 top
C12  22.78,7.38 315 top
D1  35.24,16.83 180 top
D2  20.88,6.51 270 top
F1  13.34,3.65 0 top
IC1  37.47,6.67 90 top
J4  46.04,1.27 0 top
J5  2.54,5.4 270 top
J6  10.48,1.27 0 top
J9  56.2,24.13 180 top
JP1  30.8,29.53 270 bottom  (outside the outline)
JP2  21.59,29.84 90 bottom  (outside the outline)
JP3  39.05,29.84 270 bottom  (outside the outline)
JP4  35.24,29.53 270 bottom  (outside the outline)
Q1  29.84,14.29 180 top
Q2  6.35,23.81 0 top
Q3  15.56,19.05 45 top
Q4  37.39,3.81 0 top
R1  11.75,9.53 0 top
R2  9.53,3.81 180 top
R3  2.54,23.73 90 top
R4  26.04,18.41 45 top
R5  17.46,20.95 45 top
R6  40.4,6.99 90 top
R7  22.54,5.64 0 top
R8  33.97,3.49 180 top
R9  58.42,24.13 0 top
R10  40.32,16.83 270 top
R13  26.99,17.46 45 top
R14  29.84,16.51 180 top
R15  40.72,4.76 180 top
R16  29.84,12.06 180 top
R17  27.62,14.29 90 top
SW1  15.88,7.14 0 top
TVS1  11.11,6.67 270 top
U1  53.98,12.7 270 top
U3  30.88,6.19 0 top
U4  6.99,16.51 270 top
U5  20.95,14.29 315 top
U6  36.99,11.11 270 top

### Tracks (layer width: path | path; a pad name or v marks a point on that pad's centre or on a via)
3.3V  (12 unrouted)
  Top 0.254: IC1.5 36.45,5.44 Q4.1 | R14.2 29.34,15.91 29.65,15.6 29.65,15.38 Q1.2 Q1.5 29.84,12.58 29.91,12.51 R16.1 | Q3.5 Q3.2 | R3.8 R3.5 5.25,24.31 Q2.1 | R9.2 C4.1 60.17,23.34 59.7,22.88 U1.2 | U4.17 9.04,11.76 C1.1
  Top 0.508: IC1.5 35.69,6.19 U3.4 U3.2 27.61,6.12 C2.1
5V  (7 unrouted)
  Top 0.254: 32.51,3.88 32.75,4.12 35.24,4.12 35.42,3.94 36.95,3.94 37.62,3.28 39.04,3.28 39.21,3.46 39.21,4.17 39.8,4.76 R15.2 40.4,4.95 R6.1 | C10.1 24.74,17.71 U5.42 | C9.1 C10.1 | C10.1 25.28,19.02 25.32,18.98 26.18,18.98 R4.2 R13.2 | R5.8 R5.6 | U5.14 15.21,11.77 C8.1 | C7.1 23.82,9.63 U5.28
  Top 0.508: 32.51,3.88 U3.3 27.1,4.45 C3.1 | F1.2 14.41,3.98 14.41,8.32 13.65,9.08 13.65,10.69 C8.1
BLU
  Top 0.254: D1.6 38.99,17.18 38.99,16.85 39.5,16.34 R10.5
CC1
  Top 0.254: R1.1 10.49,8.78 9.74,8.78 9.57,8.6 9.57,7.62 8.59,6.65 J5.A5
CC2
  Top 0.254: J5.B5 7.68,3.69 8.49,3.69 8.6,3.81 R2.2
D_N  (via drill 0.35)
  Top 0.254: TVS1.3 10,7.91 10,7.44 8.7,6.15 J5.B7 6.62,6.15 v6.38,6.39 | U4.14 5.08,10.56 4.6,10.08 4.6,6.51 5.96,5.15 J5.A7 9.24,5.15 v9.34,5.24
  Bottom 0.254: v9.34,5.24 8.19,6.39 v6.38,6.39
D_P  (via drill 0.35)
  Top 0.254: TVS1.1 12.06,7.3 11.43,6.67 v10.16,6.67 9.84,6.67 8.81,5.65 J5.A6 7.59,5.69 6.15,5.69 5.08,6.76 5.08,9.84 6.35,11.11 U4.15 | J5.B6 6.51,4.65 v6.35,4.49
  Bottom 0.254: v6.35,4.49 9.57,4.49 10.16,5.08 v10.16,6.67
ESP_ACK  (1 unrouted)
  Top 0.254: Q1.4 29.34,13.14 R16.2
ESP_BLUE
  Top 0.254: U1.12 47.01,20.88 46.35,20.23 41.65,20.23 39.5,18.07 R10.4
ESP_CS  (via drill 0.35)
  Top 0.254: U1.29 49.08,3.92 49.08,4.33 47.59,5.82 45.9,5.82 45.45,5.37 43.3,5.37 v43.23,5.44 | IC1.1 v37.47,5.71 37.07,6.11 37.07,6.24 36.91,6.39 36.91,6.94 37.07,7.1 37.07,8.02 36.16,8.93 36.16,9.88 35.88,10.16 34.09,10.16 U6.6
  Bottom 0.254: v43.23,5.44 37.74,5.44 v37.47,5.71
ESP_EN  (via drill 0.35)  (1 unrouted)
  Top 0.254: J6.13 41.2,1.52 C6.2 42.2,3.33 v42.23,3.3 | R9.1 57.91,23.61 58.44,23.08 U1.3 58.44,8.59 57.58,7.73 46.09,7.73 45.87,7.96 45.32,7.96 44.94,7.58 44.94,7.03 45,6.96 v45,6.46
  Bottom 0.254: v42.23,3.3 42.55,3.3 42.62,3.38 44.13,3.38 44.83,4.08 44.83,5.36 45,5.53 v45,6.46
ESP_GREEN
  Top 0.254: R10.2 40.64,17.47 40.64,17.99 42.01,19.37 48.9,19.37 49.55,20.02 U1.10
ESP_IO0
  Top 0.203: 41.59,4.14 41.7,4.14 41.9,3.94 42.73,3.94 43.13,3.54
  Top 0.254: R8.1 36.1,3.49 Q4.2 37.13,3.15 37.44,2.85 39.22,2.85 39.65,3.28 39.65,3.85 39.93,4.14 41.59,4.14 | U1.25 43.5,2.48 J6.14 43.5,3.17 43.13,3.54
ESP_MISO  (via drill 0.35)
  Top 0.254: U1.37 59.24,3.92 59.24,6.46 58.4,7.3 v45.59,7.3 | v37.57,6.67 IC1.2
  Bottom 0.254: v45.59,7.3 38.2,7.3 v37.57,6.67
ESP_MOSI  (via drill 0.35)
  Top 0.254: U1.13 45.27,21.48 45.27,21.07 44.86,20.66 41.36,20.66 40.75,20.06 40.55,20.06 v39.17,18.68 | U6.15 39.33,12.74 39.05,13.02 v39.05,14.42
  Bottom 0.254: v39.17,18.68 39.17,14.54 v39.05,14.42
ESP_RED
  Top 0.254: R10.3 40.14,17.47 40.14,18.1 41.83,19.8 47.74,19.8 48.27,20.34 U1.11
ESP_RX  (via drill 0.35)
  Top 0.254: U6.10 40.9,9.49 v40.94,9.53 | v44.01,9.53 50.8,9.53 51.44,8.89 55.59,8.89 v55.88,8.6 | v55.88,4.76 55.9,4.75 U1.34
  Bottom 0.254: v40.94,9.53 v44.01,9.53 | v55.88,8.6 v55.88,4.76
ESP_RX_5V  (via drill 0.35)  (1 unrouted)
  Top 0.254: U6.9 40.68,8.06 40.85,8.06 41.16,7.75 41.16,6.2 41.7,5.66 42.07,5.66 42.96,4.78 43.5,4.78 43.66,4.94 45.63,4.94 46.08,5.39 46.65,5.39 v47.31,4.73
  Bottom 0.254: v47.31,4.73 47.31,3.89 47.94,3.26 50.89,3.26 52.88,1.27 J4.4
ESP_SCK
  Top 0.254: U1.30 50.35,3.92 50.35,4.33 48.42,6.25 45.73,6.25 45.27,5.8 44.11,5.8 43.82,6.09 41.88,6.09 41.59,6.38 41.59,10.48 41.28,10.79 U6.12
ESP_SCL  (via drill 0.35)
  Top 0.254: v52.07,5.42 57.76,5.42 58.44,4.75 U1.36
  Bottom 0.254: v52.07,5.42 51.77,5.12 51.77,4.49 50.97,3.69 48.58,3.69 47.97,4.3 47.97,5 47.58,5.39 46.08,5.39 45.7,5 45.7,4.46 45.72,4.44 45.72,3.49 44.74,2.52 42.98,2.52 42.46,1.99 42,1.99 41.47,2.52 40.44,2.52 39.2,1.27 J6.12
ESP_SDA  (via drill 0.35)
  Top 0.254: v51.12,4.76 54.29,4.76 54.62,4.43 U1.33
  Bottom 0.254: J6.11 37.15,2.54 39.86,2.54 40.26,2.95 41.65,2.95 42.14,2.46 42.31,2.46 42.8,2.95 44.56,2.95 45.27,3.65 45.27,5.18 45.9,5.82 47.76,5.82 48.4,5.18 48.4,4.62 48.9,4.12 50.48,4.12 v51.12,4.76
ESP_TX  (via drill 0.35)
  Top 0.254: R14.1 30.59,16.27 Q1.1 30.59,14.49 32.41,12.68 v32.41,10.8 | v56.83,8.57 56.54,8.87 56.54,14.06 56.02,14.57 51.27,14.57 47.49,10.79 v44.13,10.79 | v57.15,4.76 57.16,4.75 U1.35
  Bottom 0.254: v32.41,10.8 v32.41,10.79 v44.13,10.79 | v56.83,8.57 56.83,5.08 v57.15,4.76
ESP_TX_5V  (via drill 0.35)  (1 unrouted)
  Top 0.254: v46.35,4.73 46.04,4.73 45.81,4.5 43.84,4.5 43.68,4.35 42.38,4.35 v42.13,4.6 41.97,4.76 R15.1 | Q1.6 30.59,12.84 30.93,12.51 30.93,11.31 v30.19,10.58 | v30.16,5.41 32.74,5.41 v32.75,5.4
  Bottom 0.254: J4.3 50.66,1.27 49.1,2.83 47.02,2.83 46.35,3.49 v46.35,4.73 | v30.19,10.58 30.19,5.44 v30.16,5.41 | v32.75,5.4 36.85,5.4 37.25,5 41.73,5 v42.13,4.6
GND  (via drill 0.35)  (15 unrouted)
  Top 0.254: TVS1.2 11.11,8.73 11.27,8.89 12.22,8.89 12.26,8.92 R1.2
  other vias: 50.16,11.75
  pour Top (isolate 0.203): 0,25.4 62.23,25.4 62.23,0 0,0
  pour Bottom (isolate 0.203): 0,25.4 62.23,25.4 62.23,0 0,0
GRN
  Top 0.254: D1.4 38.94,15.13 38.99,15.08 40.01,15.08 40.57,15.64 R10.7
IO0_5V  (1 unrouted)
  Top 0.254: 40.4,7.42 R6.2 39.96,7.05 39.95,7.05 39.77,6.87 39.77,5.35 38.33,3.9 Q4.3
N$2
  Top 0.254: R7.1 D2.C
N$3  (1 unrouted)
PA0_D2  (via drill 0.35)
  Top 0.254: 22.59,17.1 22.63,17.14 22.73,17.14 U5.44 24.02,18.43 v24.08,18.43 | v27.34,18.77 31.43,18.77 32.04,19.38 38.19,19.38 v38.42,19.61 | v44.77,18.71 44.99,18.94 49.07,18.94 50.81,20.67 v52.39,20.67
  Bottom 0.254: v24.08,18.43 24.42,18.77 v27.34,18.77 | J9.3 52.39,22.86 v52.39,20.67 | v44.77,18.71 43.87,19.61 v38.42,19.61
PA1_D7  (1 unrouted)
  Top 0.254: U5.45 22.33,17.46 22.23,17.46 | 22.23,17.46
PA2_D20_SDA  (1 unrouted)
  Top 0.254: U5.46 21.93,17.78 21.91,17.78
PA3_D21_SCL  (1 unrouted)
  Top 0.254: U5.47 22.3,18.81 21.59,18.1
PA4_D24_TX2  (1 unrouted)
PA5_D23_RX2  (1 unrouted)
PA6_D28  (1 unrouted)
PA7_D29
  Top 0.254: U5.3 23.69,14.07 26.25,14.07 29.54,10.79 29.54,10.3 29.92,9.92 32.46,9.92 33.33,10.79 U6.5
PB0_D9~
  Top 0.254: U5.4 18.89,18.22 18.48,18.63 18.48,20.06 20,21.59 32.38,21.59 33.34,22.54 J9.10
PB1_D10~  (1 unrouted)
  Top 0.254: U5.5 19.37,16.95 19.37,16.51
PB2_D5~  (1 unrouted)
  Top 0.254: U5.6 18.73,16.87 18.73,16.51
PB4_D27_TX0
  Top 0.254: R5.3 16.72,19.86 Q3.3 17.04,18.63 17.04,17.12 U5.8
PB5_D26_RX0
  Top 0.254: U5.9 16.56,16.88 15.88,16.88 14.88,17.89 14.86,17.89 14.39,18.36 Q3.6 14.27,19.28 14.27,19.89 15.51,21.13 R5.1
PC0_MOSI  (via drill 0.35)
  Top 0.254: v32.07,8.14 31.59,8.62 29.35,8.62 28.14,9.83 28.14,10.35 27.18,11.31 26.34,11.31 v26.17,11.48 | U5.10 16.66,15.99 16.25,16.41 16,16.41 15.24,15.65 15.24,15.4 17.89,12.76 v23.88,12.76 | v37.47,9.86 38.55,9.86 39.11,10.42 39.11,11.8 39.37,12.06 39.88,12.06 U6.14
  Bottom 0.254: v37.47,9.86 37.47,9.48 37.48,9.47 37.48,8.93 36.7,8.14 v32.07,8.14 | v26.17,11.48 24.89,12.76 v23.88,12.76
PC1_MISO  (via drill 0.35)
  Top 0.254: U5.11 18.16,13.85 22.53,13.85 v22.76,14.07 | v26.61,10.59 26.61,9.09 26.57,9.05 26.57,7.96 27.04,7.49 32.59,7.49 33.15,8.04 35,8.04 35.43,7.62 IC1.4
  Bottom 0.254: v22.76,14.07 25.76,14.07 27.14,12.69 27.14,11.27 26.61,10.75 v26.61,10.59
PC2_SCK  (via drill 0.35)
  Top 0.254: U6.11 39.71,9.95 39.28,9.95 38.54,9.2 v36.82,9.2 | v32.7,8.83 32.48,9.06 29.53,9.06 28.57,10.01 28.57,10.53 26.76,12.34 v26.4,12.34 | v24.54,13.41 17.88,13.41 U5.12
  Bottom 0.254: v26.4,12.34 25.33,13.41 v24.54,13.41 | v36.82,9.2 36.2,8.57 32.96,8.57 v32.7,8.83
PC4_D1_TX1  (via drill 0.35)
  Top 0.254: U5.16 16.38,11.51 v16.38,11.43 | v55.56,20.64 56.4,19.8 56.4,16.45 55.38,15.44 50.91,15.44 48.03,12.56 v44.13,12.56 | v38.42,12.38 v35.1,12.38
  Bottom 0.254: J9.2 53.66,22.54 v55.56,20.64 | v44.13,12.56 38.6,12.56 v38.42,12.38 | v35.1,12.38 29.84,12.38 27.35,9.89 17.93,9.89 v16.38,11.43
PC5_D0_RX1  (via drill 0.35)
  Top 0.254: U5.17 17.45,11.79 17.04,11.38 17.04,10.98 15.51,9.45 v15.19,9.45 | v56.83,20.67 56.83,16.28 55.56,15.01 51.09,15.01 47.76,11.68 v44.13,11.68 | v38.45,11.45 v35.1,11.45
  Bottom 0.254: J9.1 56.2,21.3 v56.83,20.67 | v44.13,11.68 38.67,11.68 v38.45,11.45 | v35.1,11.45 32.69,11.45 32.68,11.46 30.14,11.46 28.14,9.45 v15.19,9.45
PC6_D4  (1 unrouted)
  Top 0.254: U5.18 18.37,12.06 18.41,12.06
PD0_A0
  Top 0.254: J6.5 18.73,3.17 16.51,3.17 15.84,3.85 15.84,4.68 14.97,5.55 14.97,8.3 17.04,10.37 18.05,10.37 18.46,10.79 U5.20
PD1_A1
  Top 0.254: J6.6 22.4,1.27 21.15,2.52 20,2.52 18.91,3.61 16.69,3.61 16.27,4.02 16.27,4.86 15.4,5.73 15.4,8.12 17.22,9.94 18.33,9.94 18.82,10.43 U5.21
PD2_A2
  Top 0.254: J6.7 24.94,1.27 23.26,2.95 20.18,2.95 19.09,4.04 17.11,4.04 16.7,4.45 16.7,5.04 15.83,5.91 15.83,7.62 15.83,7.94 17.4,9.51 18.62,9.51 19.18,10.07 U5.22
PD3_A3
  Top 0.254: U5.23 18.82,8.93 17.42,8.93 16.26,7.76 16.26,6.09 17.14,5.21 17.14,4.62 17.29,4.47 19.27,4.47 20.36,3.38 23.44,3.38 24.3,2.52 26.23,2.52 27.48,1.27 J6.8
PD4_A4
  Top 0.254: J6.9 30.02,1.27 28.77,2.52 26.84,2.52 26.41,2.95 24.48,2.95 23.62,3.81 20.54,3.81 19.45,4.9 17.88,4.9 17.61,5.17 17.61,5.35 16.69,6.27 16.69,7.58 17.6,8.49 19.11,8.49 U5.24
PD5_A5
  Top 0.203: 27.02,2.95 26.99,2.95 26.55,3.38
  Top 0.254: U5.25 20.94,8.35 20.42,8.35 19.51,7.44 19.51,5.45 20.72,4.24 23.8,4.24 24.66,3.38 25.16,3.38 26.55,3.38 | J6.10 32.56,1.27 30.88,2.95 27.02,2.95
PD6_A6
  Top 0.254: U5.26 22.3,9.64 22.71,9.22 22.71,8.97 22.32,8.58 22.07,8.58 D2.A
PD7_A7_AREF  (1 unrouted)
  Top 0.254: U5.27 23.39,9.34 C11.1 C12.1
PE0_D11  (1 unrouted)
  Top 0.254: U5.30 23.78,11.14 24.45,10.48
PE1_D12  (1 unrouted)
  Top 0.254: U5.31 23.28,12.32 23.18,12.32
PE2_D13  (1 unrouted)
  Top 0.254: U5.32 25,11.31 25,11.11
PE3_D8  (1 unrouted)
  Top 0.254: U5.33 25.44,11.6 25.44,11.11
PF2_D35_A12
  Top 0.254: U6.7 29.71,9.49 29.1,10.09 29.1,10.61 26.41,13.3 U5.36
PF3_D36_A13
  Top 0.254: U5.37 26.37,14.79 R17.2 28.02,15.19 Q1.3
PF4_D6~  (1 unrouted)
  Top 0.254: U5.38 25.61,15.63 26.02,16.05 26.27,16.05 26.56,15.76
PF5_D3~  (1 unrouted)
  Top 0.254: U5.39 25.69,16.51 26.04,16.51
PF6_RST  (via drill 0.35)
  Top 0.254: R13.1 25.57,17.1 U5.40 24.15,15.69 24.15,15.6 23.7,15.14 v23.7,14.99 | v18.27,5.6 v18.27,5.61 SW1.2 19.19,8.06 19.33,8.06 20.74,9.47 20.74,9.73 19.68,10.78 v19.68,11.75
  Bottom 0.254: v18.27,5.6 15.56,2.89 J6.3 | v19.68,11.75 22.1,14.16 22.1,14.34 22.75,14.99 v23.7,14.99
RED
  Top 0.254: R10.6 40.01,16.18 40.01,15.69 39.83,15.51 39.17,15.51 37.85,16.83 D1.5
RESETN  (via drill 0.35)
  Top 0.254: R3.2 2.23,23.09 2.23,22.59 1.88,22.24 1.88,20.08 1.27,19.48 v1.27,19.05 U4.11 | J9.19 8.22,24.13 7.29,25.05 1.38,25.05 0.53,24.2 v0.53,22.33
  Bottom 0.254: v0.53,22.33 0.53,19.79 v1.27,19.05
RX_D11  (via drill 0.35)
  Top 0.254: R3.1 1.27,22.71 U4.10 1.27,20.09 0.6,19.42 0.6,17.48 v0.61,17.46 | Q3.4 16.02,19.65 v16.02,19.52 | v13.77,18.12 13.54,17.89 3.63,17.89 v3.2,17.46
  Bottom 0.254: v16.02,19.52 15.16,19.52 v13.77,18.12 | v3.2,17.46 v0.61,17.46
SWCLK  (via drill 0.35)
  Top 0.254: U4.12 v2.54,13.65 2.54,19.4 3.15,20 3.15,22.15 2.79,22.5 R3.3
  Bottom 0.254: J6.2 11.25,3.04 11.25,7.5 5.09,13.65 v2.54,13.65
SWDIO  (via drill 0.35)
  Top 0.254: v3.95,10.33 3.81,10.46 U4.13
  Bottom 0.254: J6.1 10.48,4.79 10.82,5.13 10.82,7.32 7.59,10.55 5.85,10.55 5.63,10.33 v3.95,10.33
TX_D11  (via drill 0.35)
  Top 0.254: R5.4 v17.64,19 | U4.9 2.54,20.01 1.96,19.43 1.96,15.91 1.88,15.83 1.88,10.93 2.16,10.65 2.92,10.65 3.2,10.93 3.2,16.53 4.13,17.46 14.37,17.46 v14.8,17.03 | Q3.1 15.13,18.41 v15.13,18.55
  Bottom 0.254: v14.8,17.03 15.72,17.94 | 15.72,17.94 16.78,19 v17.64,19 | v15.13,18.55 15.72,17.96 15.72,17.94
UPDI
  Top 0.254: U4.6 U4.7 5.41,21.45 Q2.2 R3.4
UPDI_5V  (via drill 0.35)
  Top 0.254: R4.1 25.68,17.93 U5.41 23.62,15.88 v23.5,15.88 | Q2.3 8.73,22.37 9.27,22.37 9.55,22.09 9.55,20.08 11.09,18.55 v12.7,18.55 | v17.74,15.2 21.55,15.2 v21.59,15.24
  Bottom 0.254: v12.7,18.55 13.11,18.14 13.11,17.79 15.7,15.2 v17.74,15.2 | v21.59,15.24 22.23,15.88 v23.5,15.88
V_USB  (via drill 0.35)
  Top 0.406: J5.A4B9 6.78,7.85 6.49,7.56 6.26,7.56 v5.74,7.03 | v5.71,3.81 6.29,3.24 6.49,3.24 6.78,2.95 J5.B4A9
  Top 0.508: J5.B4A9 11.23,2.95 F1.1 11.11,4.47 TVS1.5
  Bottom 0.406: v5.74,7.03 5.4,6.69 5.4,4.13 v5.71,3.81